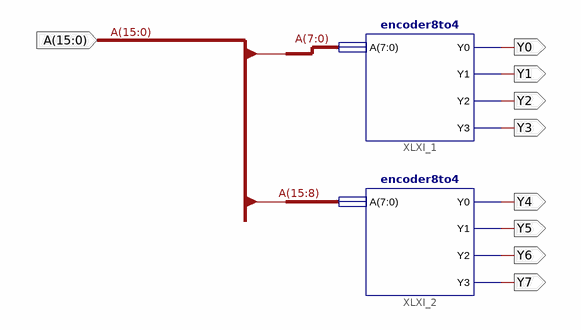
[diagram p0: schematic sheet 1]
// Xilinx ISE schematic encoder16to8.sch (spartan3e) as structural Verilog: 2 symbols, 9 ports
module encoder16to8 (
  input  [15:0] A,
  output Y0,
  output Y1,
  output Y2,
  output Y3,
  output Y4,
  output Y5,
  output Y6,
  output Y7
);

  encoder8to4 XLXI_1 (.A(A[7:0]), .Y0(Y0), .Y1(Y1), .Y2(Y2), .Y3(Y3));
  encoder8to4 XLXI_2 (.A(A[15:8]), .Y0(Y4), .Y1(Y5), .Y2(Y6), .Y3(Y7));
endmodule
